# EAGLE design lampu_tidur (EAGLE 6.5.0)
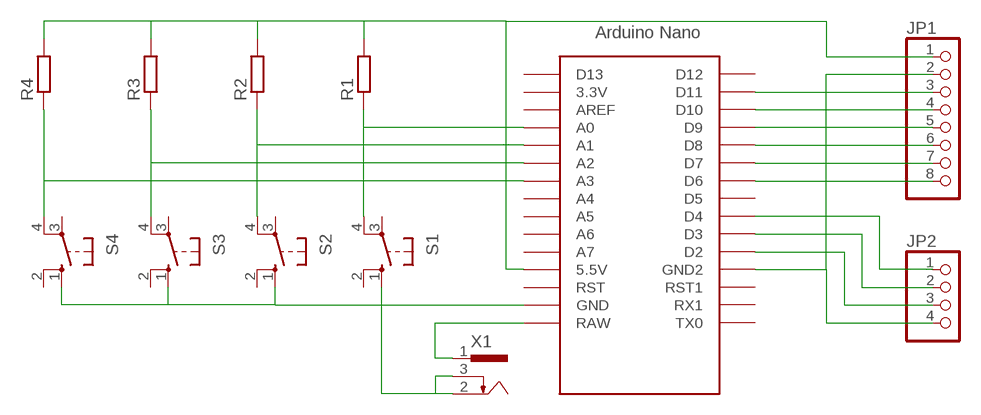
[diagram p0: schematic, sheet 1]

## Parts
JP1  PINHD-1X8  [1X08]
JP2  PINHD-1X4  [1X04]
R1  R-EU_0204/7  [0204/7]
R2  R-EU_0204/7  [0204/7]
R3  R-EU_0204/7  [0204/7]
R4  R-EU_0204/7  [0204/7]
S1  10-XX  [B3F-10XX]
S2  10-XX  [B3F-10XX]
S3  10-XX  [B3F-10XX]
S4  10-XX  [B3F-10XX]
U$1  NANO  [NANO]
X1  733980-62  [733980-62]

## Nets
N$1: JP1.1 R1.2 R2.2 R3.2 R4.2 U$1.5V(5.5V)
N$2: R1.1 S1.4(P1) U$1.A0
N$3: S1.1(S) S2.1(S) S3.1(S) S4.1(S) U$1.GND X1.2 X1.3
N$4: R2.1 S2.4(P1) U$1.A1
N$5: U$1.RAW X1.1
N$6: R3.1 S3.4(P1) U$1.A2
N$8: R4.1 S4.4(P1) U$1.A3
N$10: JP1.8 U$1.D6
N$11: JP1.7 U$1.D7
N$12: JP1.6 U$1.D8
N$13: JP1.5 U$1.D9
N$14: JP1.4 U$1.D10
N$15: JP2.1 U$1.D4
N$16: JP2.2 U$1.D3
N$17: JP2.3 U$1.D2
N$18: JP1.2 JP2.4 U$1.GND1(GND2)
N$19: JP1.3 U$1.D11
Unconnected: S1.2(S1) S1.3(P) S2.2(S1) S2.3(P) S3.2(S1) S3.3(P) S4.2(S1) S4.3(P) U$1.3.3V U$1.A4 U$1.A5 U$1.A6 U$1.A7 U$1.AREF U$1.D5 U$1.D12 U$1.D13 U$1.ICSP1 U$1.ICSP2 U$1.ICSP3 U$1.ICSP4 U$1.ICSP5 U$1.ICSP6 U$1.RST U$1.RST1 U$1.RX1 U$1.TX0

## Library data of the parts
JP1 = pinhead:PINHD-1X8: PIN HEADER
JP2 = pinhead:PINHD-1X4: PIN HEADER
R1-R4 = resistor:R-EU_: RESISTOR, European symbol
S1-S4 = switch-omron:10-XX: OMRON SWITCH; MPN: B3F-1000; OC_FARNELL: 176432; OC_NEWARK: 36M3542
U$1 = Arduino-clone:NANO: Arduino Nano
X1 = con-conrad:73398?: FEMALE PRINT CONNECTOR Niedervolt-Steckverbinder Distributor Conrad

## Board
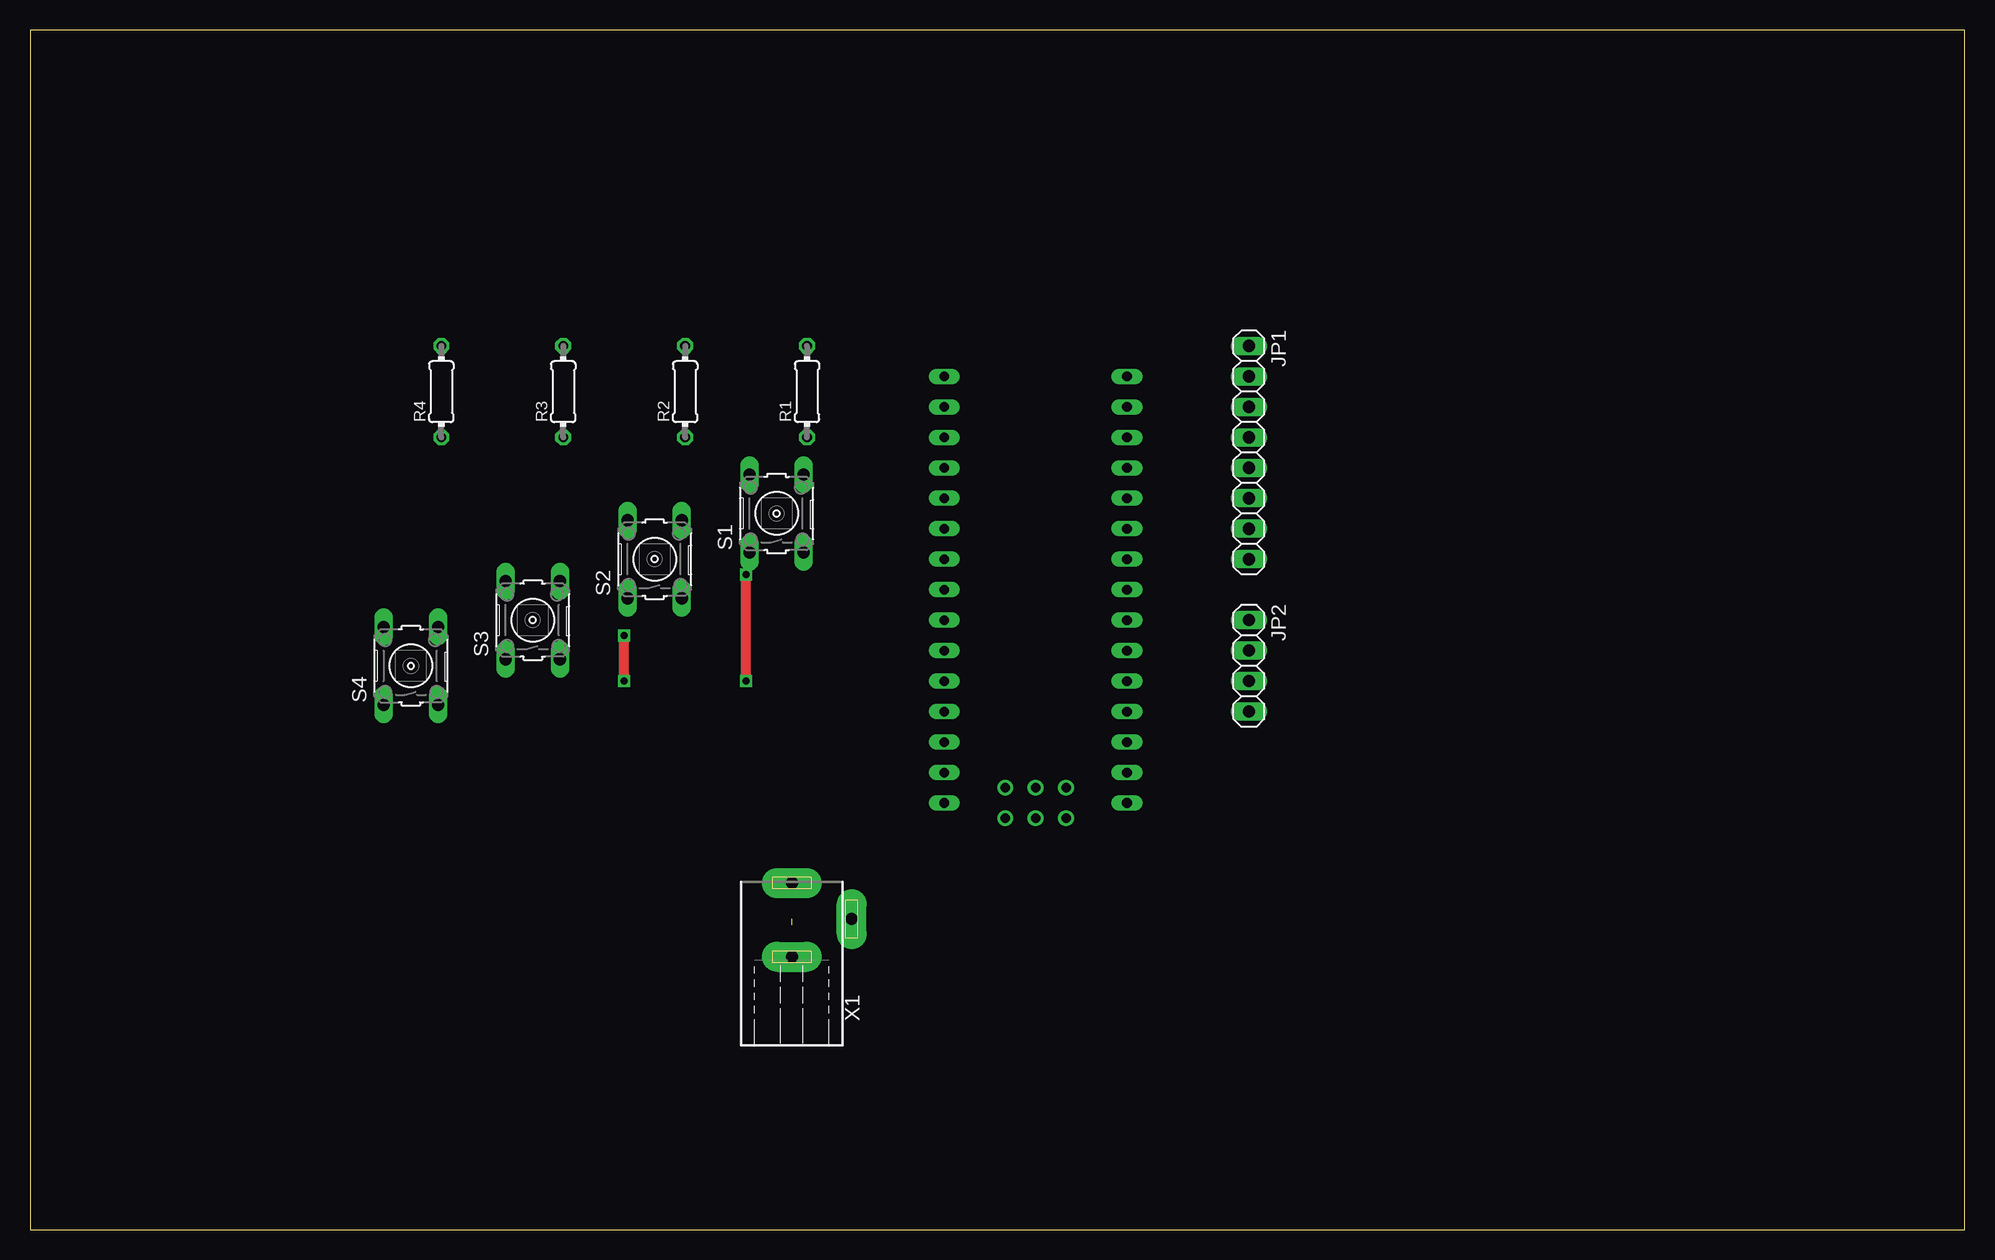
[diagram p1: board, top side]
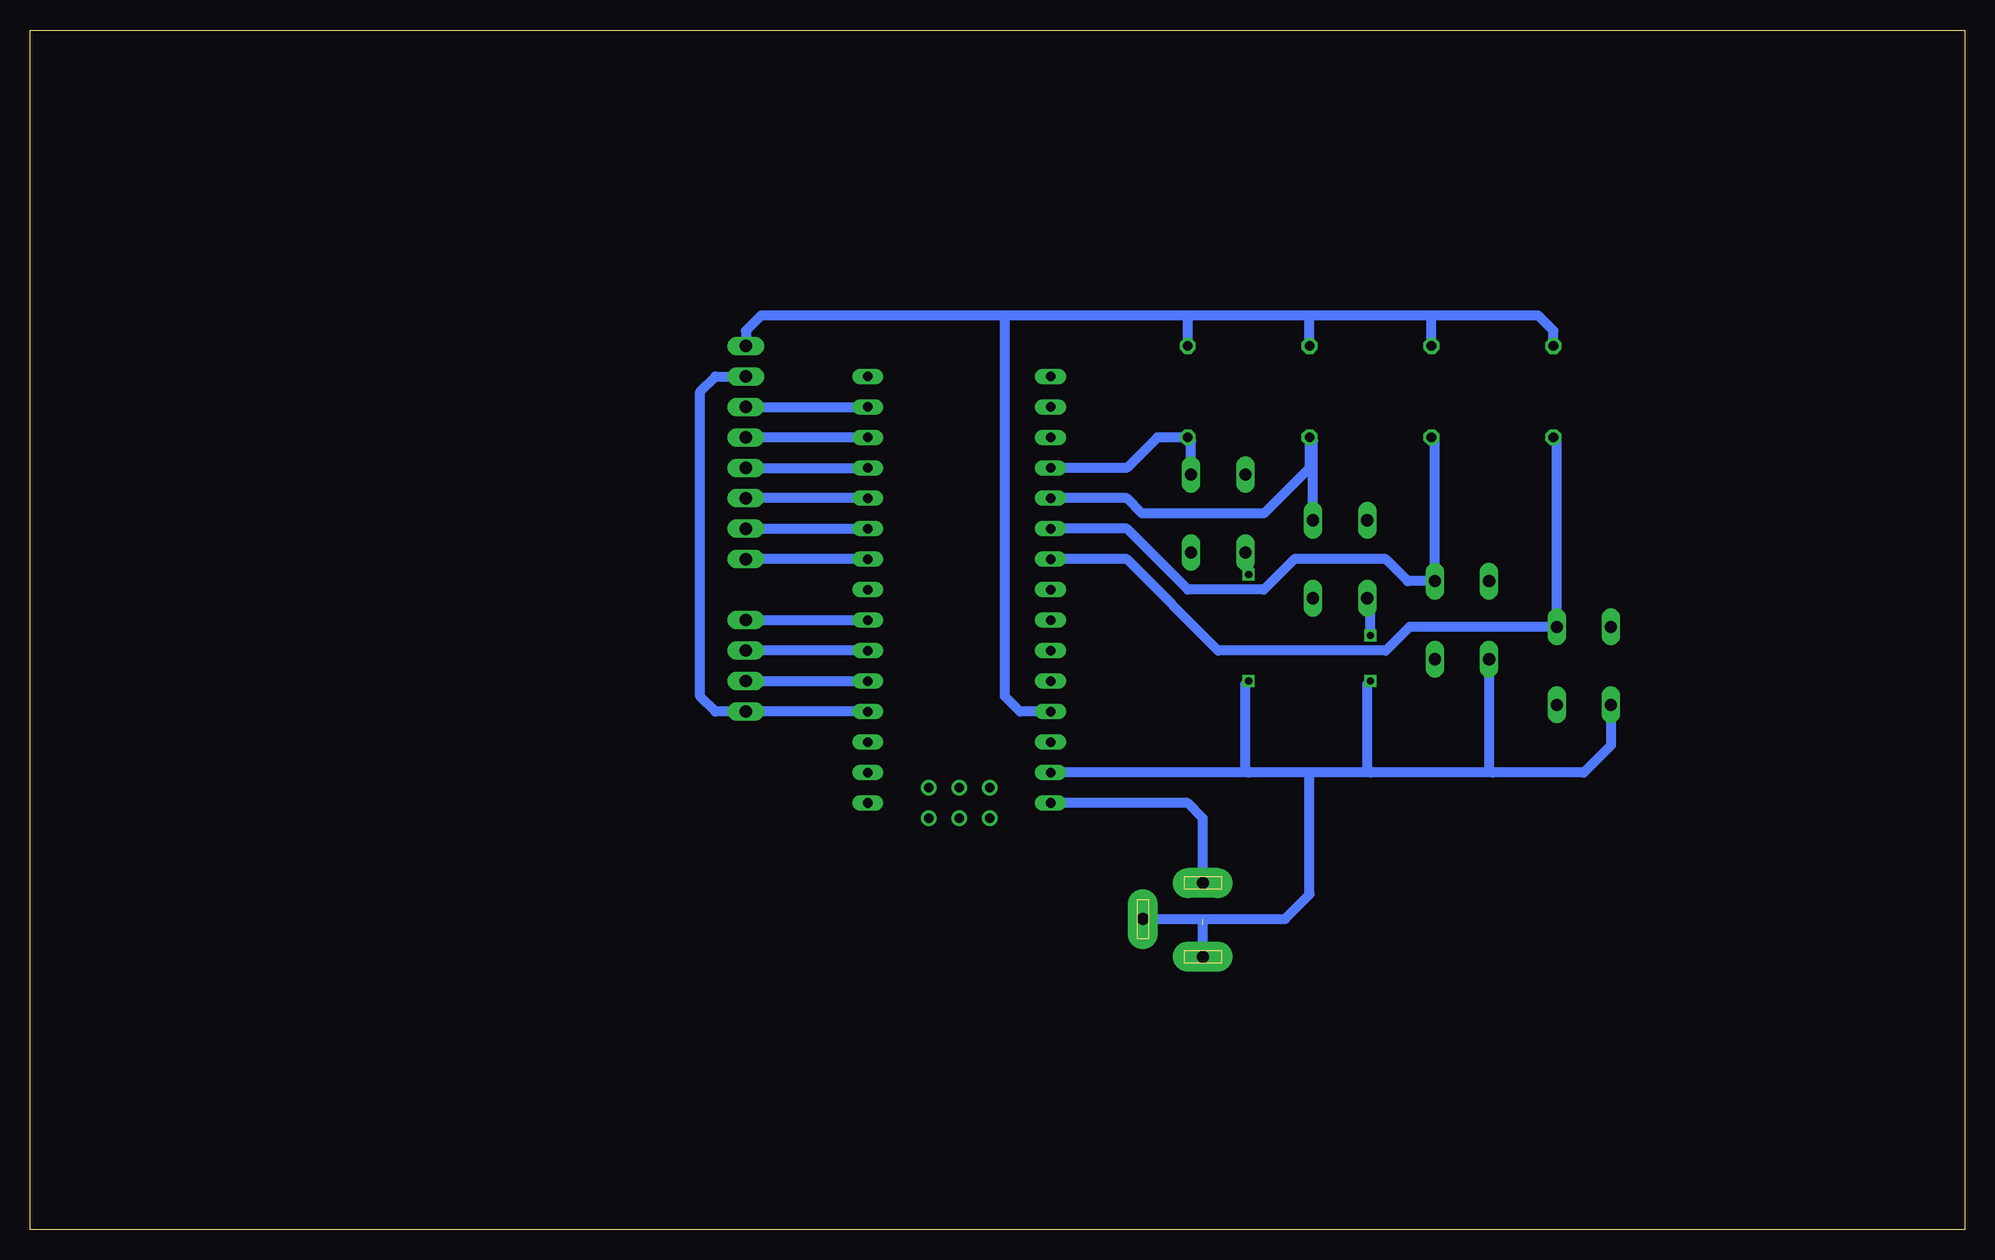
[diagram p2: board, bottom side, seen from below]

Size 161.27 x 100 mm. Coordinates in mm from the lower left corner, seen from the top.
Outline: 0,0 161.27,0 161.27,100 0,100 0,0
Copper layers (1*16): Top 0.035mm / dielectric 1.5mm / Bottom 0.035mm
Design rules "default": minimum track width 10mil, minimum drill 24mil, track to track 8mil, track to pad 8mil, pad to pad 8mil, via to via 8mil, smd to smd 8mil, copper to edge 40mil, drill to drill 8mil, minimum pad ring 10mil, minimum via ring 8mil, stop-mask expansion 4mil, vias tented up to drill 0mil, thermal gap 10mil

### Footprints (pad centres in the part's own frame; a part is rotated, then mirrored left to right if it is on the bottom)
1X08 = drill 1.016 long: 1 -8.89,0; 2 -6.35,0; 3 -3.81,0; 4 -1.27,0; 5 1.27,0; 6 3.81,0; 7 6.35,0; 8 8.89,0
1X04 = drill 1.016 long: 1 -3.81,0; 2 -1.27,0; 3 1.27,0; 4 3.81,0
0204/7 = drill 0.813 octagon: 1 -3.81,0; 2 3.81,0
B3F-10XX = drill 1.016 long: 1 -3.251,2.261; 2 3.251,2.261; 3 -3.251,-2.261; 4 3.251,-2.261
NANO = drill 0.8 long: 3.3V -10.16,24.13; 5V -10.16,-1.27; A0 -10.16,19.05; A1 -10.16,16.51; A2 -10.16,13.97; A3 -10.16,11.43; A4 -10.16,8.89; A5 -10.16,6.35; A6 -10.16,3.81; A7 -10.16,1.27; AREF -10.16,21.59; D2 5.08,1.27; D3 5.08,3.81; D4 5.08,6.35; D5 5.08,8.89; D6 5.08,11.43; D7 5.08,13.97; D8 5.08,16.51; D9 5.08,19.05; D10 5.08,21.59; D11 5.08,24.13; D12 5.08,26.67; D13 -10.16,26.67; GND -10.16,-6.35; GND1 5.08,-1.27; RAW -10.16,-8.89; RST -10.16,-3.81; RST1 5.08,-3.81; RX1 5.08,-6.35; TX0 5.08,-8.89 | drill 0.8: ICSP1 -5.08,-10.16; ICSP2 -5.08,-7.62; ICSP3 -2.54,-10.16; ICSP4 -2.54,-7.62; ICSP5 0,-10.16; ICSP6 0,-7.62
733980-62 = drill 1 pad 2.5 long: 1 0,8.57; 2 0,2.42; 3 5,5.57

### Placement (x,y rotation side)
JP1  101.6,64.77 270 top
JP2  101.6,46.99 270 top
R1  64.77,69.85 90 top
R2  54.61,69.85 90 top
R3  44.45,69.85 90 top
R4  34.29,69.85 90 top
S1  62.23,59.69 90 top
S2  52.07,55.88 90 top
S3  41.91,50.8 90 top
S4  31.75,46.99 90 top
U$1  86.36,44.45 0 top
X1  63.5,20.32 0 top

### Tracks (layer width: path | path; a pad name or v marks a point on that pad's centre or on a via)
N$1
  Bottom 0.813: R4.2 34.29,74.93 35.56,76.2 44.45,76.2 | 44.45,76.2 54.61,76.2 | R3.2 44.45,76.2 | R2.2 54.61,76.2 | 54.61,76.2 64.77,76.2 | 64.77,76.2 80.01,76.2 | 80.01,76.2 100.33,76.2 101.6,74.93 JP1.1 | R1.2 64.77,76.2 | U$1.5V 78.74,43.18 80.01,44.45 80.01,76.2
N$2
  Bottom 0.813: S1.4 64.49,65.76 R1.1 67.31,66.04 69.85,63.5 U$1.A0
N$3  (via drill 0.6)  (1 unrouted)
  Top 0.813: v49.53,45.72 v49.53,49.53 | v59.69,45.72 v59.69,54.61
  Bottom 0.813: 59.69,38.1 U$1.GND | 59.69,38.1 59.97,38.38 59.97,45.44 v59.69,45.72 | S4.1 29.49,40.36 31.75,38.1 39.37,38.1 | 39.37,38.1 49.53,38.1 | 49.53,38.1 54.61,38.1 | 54.61,38.1 59.69,38.1 | S3.1 39.65,38.38 39.37,38.1 | 49.53,38.1 49.81,38.38 49.81,45.44 v49.53,45.72 | v49.53,49.53 49.53,52.35 S2.1 | v59.69,54.61 59.69,56.16 S1.1 | X1.3 56.66,25.89 54.61,27.94 54.61,38.1 | X1.2 63.5,25.4
N$4
  Bottom 0.813: S2.4 54.33,65.76 R2.1 54.61,63.5 58.42,59.69 68.58,59.69 69.85,60.96 U$1.A1
N$5
  Bottom 0.813: X1.1 63.5,34.29 64.77,35.56 U$1.RAW
N$6
  Bottom 0.813: R3.1 44.17,65.76 S3.4 46.43,54.05 48.26,55.88 55.88,55.88 58.42,53.34 64.77,53.34 69.85,58.42 U$1.A2
N$8
  Bottom 0.813: R4.1 34.01,65.76 S4.4 46.28,50.24 48.26,48.26 62.23,48.26 69.85,55.88 U$1.A3
N$10
  Bottom 0.813: U$1.D6 JP1.8
N$11
  Bottom 0.813: JP1.7 U$1.D7
N$12
  Bottom 0.813: U$1.D8 JP1.6
N$13
  Bottom 0.813: JP1.5 U$1.D9
N$14
  Bottom 0.813: U$1.D10 JP1.4
N$15
  Bottom 0.813: JP2.1 U$1.D4
N$16
  Bottom 0.813: U$1.D3 JP2.2
N$17
  Bottom 0.813: JP2.3 U$1.D2
N$18
  Bottom 0.813: U$1.GND1 JP2.4 104.14,43.18 105.41,44.45 105.41,69.85 104.14,71.12 JP1.2
N$19
  Bottom 0.813: JP1.3 U$1.D11